# Altium schematic sheet LambdaWide.SchDoc
size A4; Organization: Altium Limited; Address1: L3, 12a Rodborough Rd; Address2: Frenchs Forest; Address3: NSW; Address4: Australia 2086
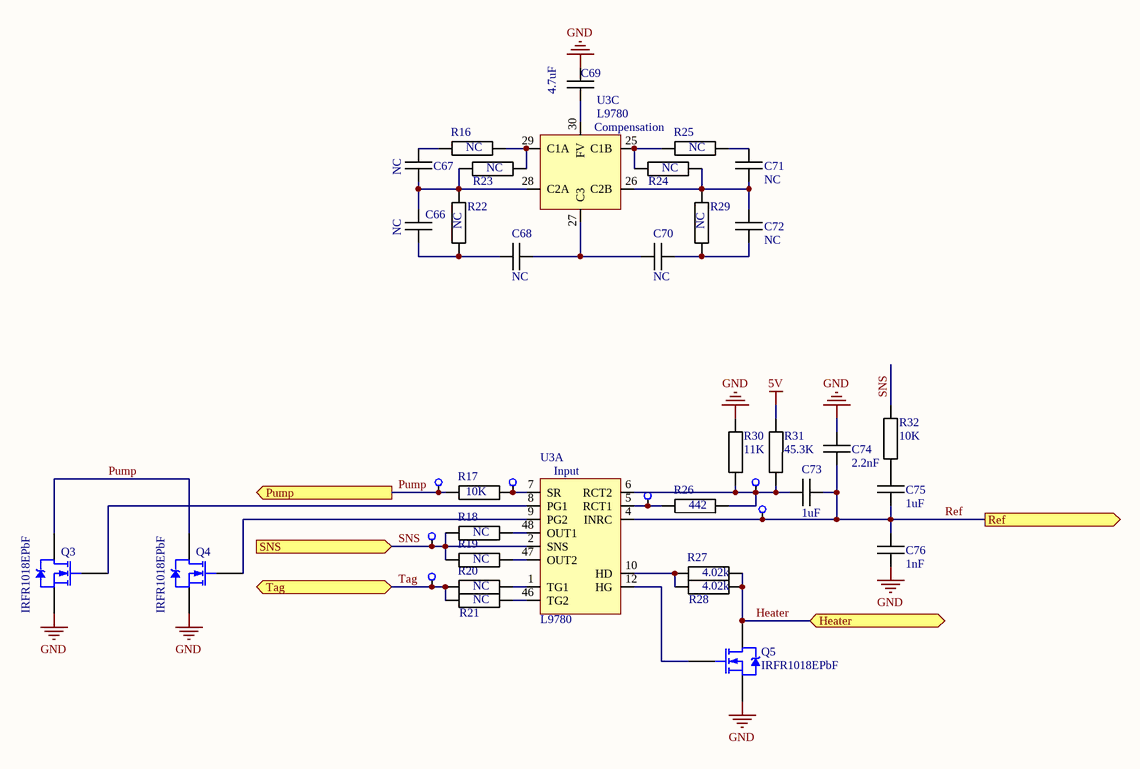
[diagram p0: LambdaWide.SchDoc]

## Parts
C66  NC  [SMD 0603]
C67  NC  [SMD 0603]
C68  NC  [SMD 0603]
C69  4.7uF  [SMD 0603]
C70  NC  [SMD 0603]
C71  NC  [SMD 0603]
C72  NC  [SMD 0603]
C73  1uF  [SMD 0603]
C74  2.2nF  [SMD 0603]
C75  1uF  [SMD 0603]
C76  1nF  [SMD 0603]
Q3  IRFR1018EPbF  [DPAK228P991X238-3M]
Q4  IRFR1018EPbF  [DPAK228P991X238-3M]
Q5  IRFR1018EPbF  [DPAK228P991X238-3M]
R16  NC  [SMD 0603]
R17  10K  [SMD 0603]
R18  NC  [SMD 0603]
R19  NC  [SMD 0603]
R20  NC  [SMD 0603]
R21  NC  [SMD 0603]
R22  NC  [SMD 0603]
R23  NC  [SMD 0603]
R24  NC  [SMD 0603]
R25  NC  [SMD 0603]
R26  442  [SMD 0603]
R27  4.02k  [SMD 0603]
R28  4.02k  [SMD 0603]
R29  NC  [SMD 0603]
R30  11K  [SMD 0603]
R31  45.3K  [SMD 0603]
R32  10K  [SMD 0603]
TP43  TestPoint  [TESTPOINT]  (value not drawn)
TP44  TestPoint  [TESTPOINT]  (value not drawn)
TP45  TestPoint  [TESTPOINT]  (value not drawn)
TP46  TestPoint  [TESTPOINT]  (value not drawn)
TP47  TestPoint  [TESTPOINT]  (value not drawn)
TP48  TestPoint  [TESTPOINT]  (value not drawn)
TP49  TestPoint  [TESTPOINT]  (value not drawn)
U3  L9780  [LQFP-48N]  (parts A,C of 4)

## Ports
Heater (bidir), Pump (out), Ref (out), SNS (in), Tag (bidir)

## Nets
5V: R31.2
GND: C69.2 C74.2 C76.1 Q3.3(S) Q4.3(S) Q5.3(S) R30.1
Heater: Q5.4(D) R27.1 R28.1 ; port Heater
Pump: Q3.4(D) Q4.4(D) R17.2 TP45.0 ; port Pump
Ref: C73.2 C74.1 C75.2 C76.2 TP49.0 U3.4(INRC) ; port Ref
SNS: R18.2 R19.2 R32.2 TP43.0 U3.2(SNS) ; port SNS
Tag: R20.2 R21.2 TP44.0 ; port Tag
NetC66_1: C66.1 C67.2 R22.1 R23.1 U3.28(C2A)
NetC66_2: C66.2 C68.2 R22.2
NetC67_1: C67.1 R16.1
NetC68_1: C68.1 C70.2 U3.27(C3)
NetC69_1: C69.1 U3.30(FV)
NetC70_1: C70.1 C72.2 R29.2
NetC71_1: C71.1 R25.1
NetC71_2: C71.2 C72.1 R24.1 R29.1 U3.26(C2B)
NetC73_1: C73.1 R26.2 R30.2 R31.1 TP48.0 U3.6(RCT2)
NetC75_1: C75.1 R32.1
NetQ3_1: Q3.1(G) U3.8(PG1)
NetQ4_1: Q4.1(G) U3.9(PG2)
NetQ5_1: Q5.1(G) U3.12(HG)
NetR16_2: R16.2 R23.2 U3.29(C1A)
NetR17_1: R17.1 TP46.0 U3.7(SR)
NetR18_1: R18.1 U3.48(OUT1)
NetR19_1: R19.1 U3.47(OUT2)
NetR20_1: R20.1 U3.1(TG1)
NetR21_1: R21.1 U3.46(TG2)
NetR24_2: R24.2 R25.2 U3.25(C1B)
NetR26_1: R26.1 TP47.0 U3.5(RCT1)
NetR27_2: R27.2 R28.2 U3.10(HD)

## Notes on the sheet
- Title
- Size:
- Date:
- A4
- Number:
- Time:
- Revision:
- Sheet
- of
- File:
- (in symbol L9780, part A) Input
- (in symbol L9780, part C) Compensation

## Library data of the parts
C66-C68 C70-C72 = Capasitor: Value: NC
C69 = Capasitor: CC0603KRX5R6BB475; Value: 4.7uF
C73 C75 = Capasitor: CL10A105KB8NNNC; Value: 1uF
C74 = Capasitor: CC0603KRX7R9BB222; Value: 2.2nF
C76 = Capasitor: CC0603KRX7R9BB102; Value: 1nF
Q3-Q5 = IRFR1018EPbF: HEXFET Power MOSFET; ComponentLink1Description: datasheet; ComponentLink1URL: https://data.electronshik.ru/z/Datasheet/I/IRFR1018EPBF.pdf
R16 R18-R25 R29 = Resistor: Value: NC
R17 R32 = Resistor: RC0603FR-0710KL; Value: 10K
R26 = Resistor: RC0603FR-07442RL; Value: 442
R27 R28 = Resistor: RC0603FR-074K02L; Value: 4.02k
R30 = Resistor: RC0603FR-0711KL; Value: 11K
R31 = Resistor: RC0603FR-0745K3L; Value: 45.3K
U3 = L9780: Wide range air fuel sensor control interface